# EAGLE design BIRDS3_-Xpanel_FM_Uguisu_v1.1 (EAGLE 9.4.0)
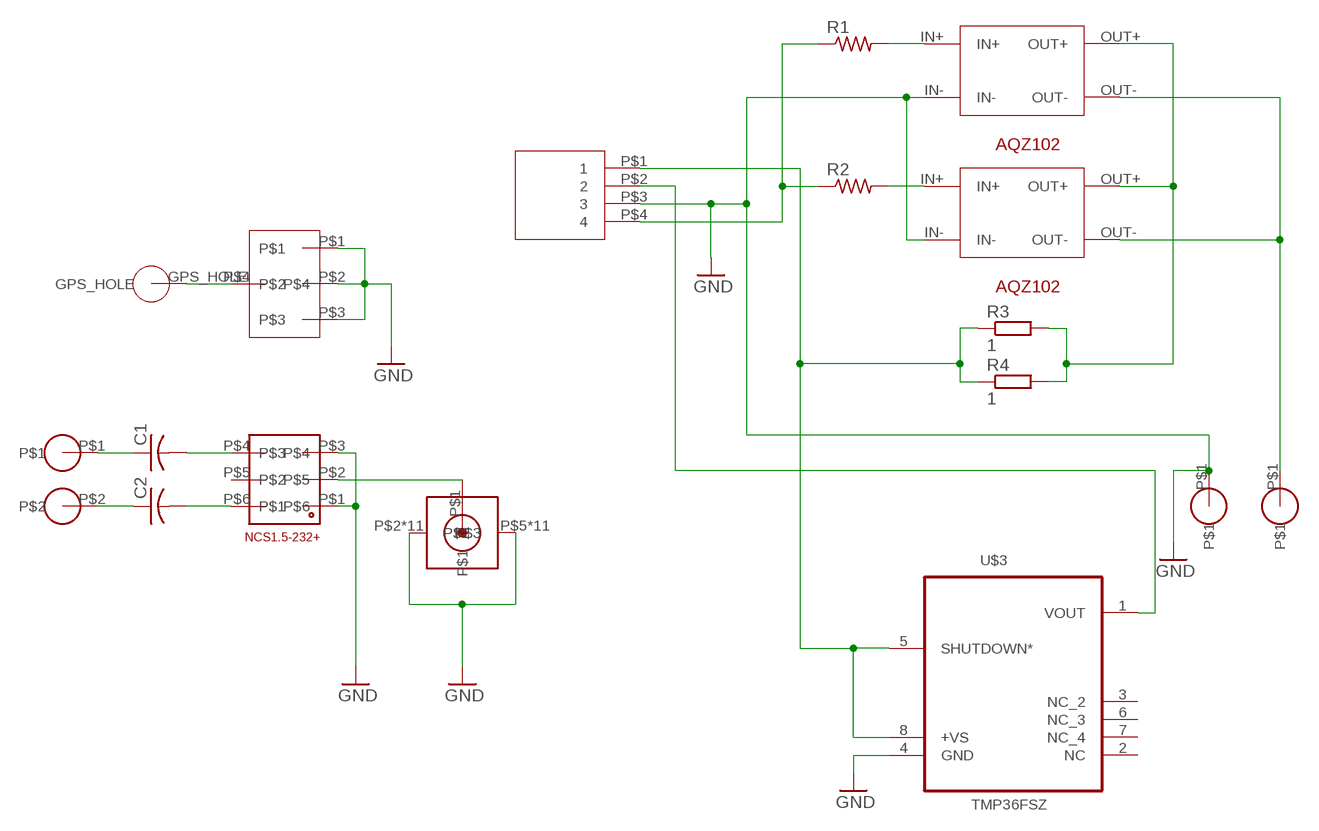
[diagram p0: schematic, sheet 1]

## Parts
142_0711_1  SMA_142_0711_301  [SMA_142_0711_301]
C1  C-USC1608  [C1608]
C2  C-USC1608  [C1608]
GPS1  GPS_HOLE  [GPS_HOLE]
K1  DIODE_X  [DIOD_X]
K2  DIODE_X  [DIOD_X]
MMCX1  MMCX_GPS  [MMCX_GPS]
NCS1  NCS1.5-232+  [NCS1.5-232+]
PRE1  FOR_DIPOLE  [FOR_DIPOLE]
R1  R-US_R0402  [R0402]
R2  R-US_R0402  [R0402]
R3  1  R-EU_R1218  [R1218]
R4  1  R-EU_R1218  [R1218]
U$1  NICR_HOLE  [NICR_HOLE]
U$2  4PIN_HEADER  [4PIN_HEADER]
U$3  TMP36FSZ  [SOIC_N]
U$4  NICR_HOLE  [NICR_HOLE]

## Nets
BC_TEMP_OUT: U$2.P$2 U$3.1(VOUT)
GND: 142_0711_1.P$2 142_0711_1.P$3 142_0711_1.P$4 142_0711_1.P$5 142_0711_1.P$6 142_0711_1.P$7 142_0711_1.P$8 142_0711_1.P$9 142_0711_1.P$10 142_0711_1.P$11 142_0711_1.P$12 142_0711_1.P$13 142_0711_1.P$14 142_0711_1.P$15 142_0711_1.P$16 142_0711_1.P$17 142_0711_1.P$18 142_0711_1.P$19 142_0711_1.P$20 142_0711_1.P$21 142_0711_1.P$22 142_0711_1.P$23 K1.IN- K2.IN- MMCX1.P$1 MMCX1.P$2 MMCX1.P$3 NCS1.P$1 NCS1.P$3 U$2.P$3 U$3.4(GND) U$4.P$1
HOT: K1.OUT- K2.OUT- U$1.P$1
MAIN_PIC_DIO: R1.1 R2.1 U$2.P$4
N$1: K2.IN+ R1.2
N$2: K1.OUT+ K2.OUT+ R3.2 R4.2
N$3: K1.IN+ R2.2
N$4: 142_0711_1.P$1 NCS1.P$2
N$5: C1.1 PRE1.P$1
N$6: C1.2 NCS1.P$4
N$7: C2.2 NCS1.P$6
N$8: C2.1 PRE1.P$2
N$33: GPS1.GPS_HOLE MMCX1.P$4
SUP_UNREG_2: R3.1 R4.1 U$2.P$1 U$3.5(SHUTDOWN*) U$3.8(+VS)
Unconnected: NCS1.P$5 U$3.2(NC) U$3.3(NC_2) U$3.6(NC_3) U$3.7(NC_4)

## Library data of the parts
142_0711_1 = SMA_142_0711_301:SMA_142_0711_301
C1 C2 = adafruit_ufl:C-US: CAPACITOR, American symbol
GPS1 = GPS_hole:GPS_HOLE
K1 K2 = BIRDS-3 lib V1.1:DIODE_X
MMCX1 = MMCX_GPS:MMCX_GPS
NCS1 = NCS1.5-232+:NCS1.5-232+
PRE1 = for_dipole:FOR_DIPOLE: VIA_M1.5
R1 R2 = adafruit_ufl:R-US_: RESISTOR, American symbol
R3 R4 = rcl:R-EU_: RESISTOR, European symbol
U$1 U$4 = Nicr_hole:NICR_HOLE
U$2 = BIRDS-3 lib V1.1:4PIN_HEADER
U$3 = TMP36FSZ:TMP36FSZ

## Board
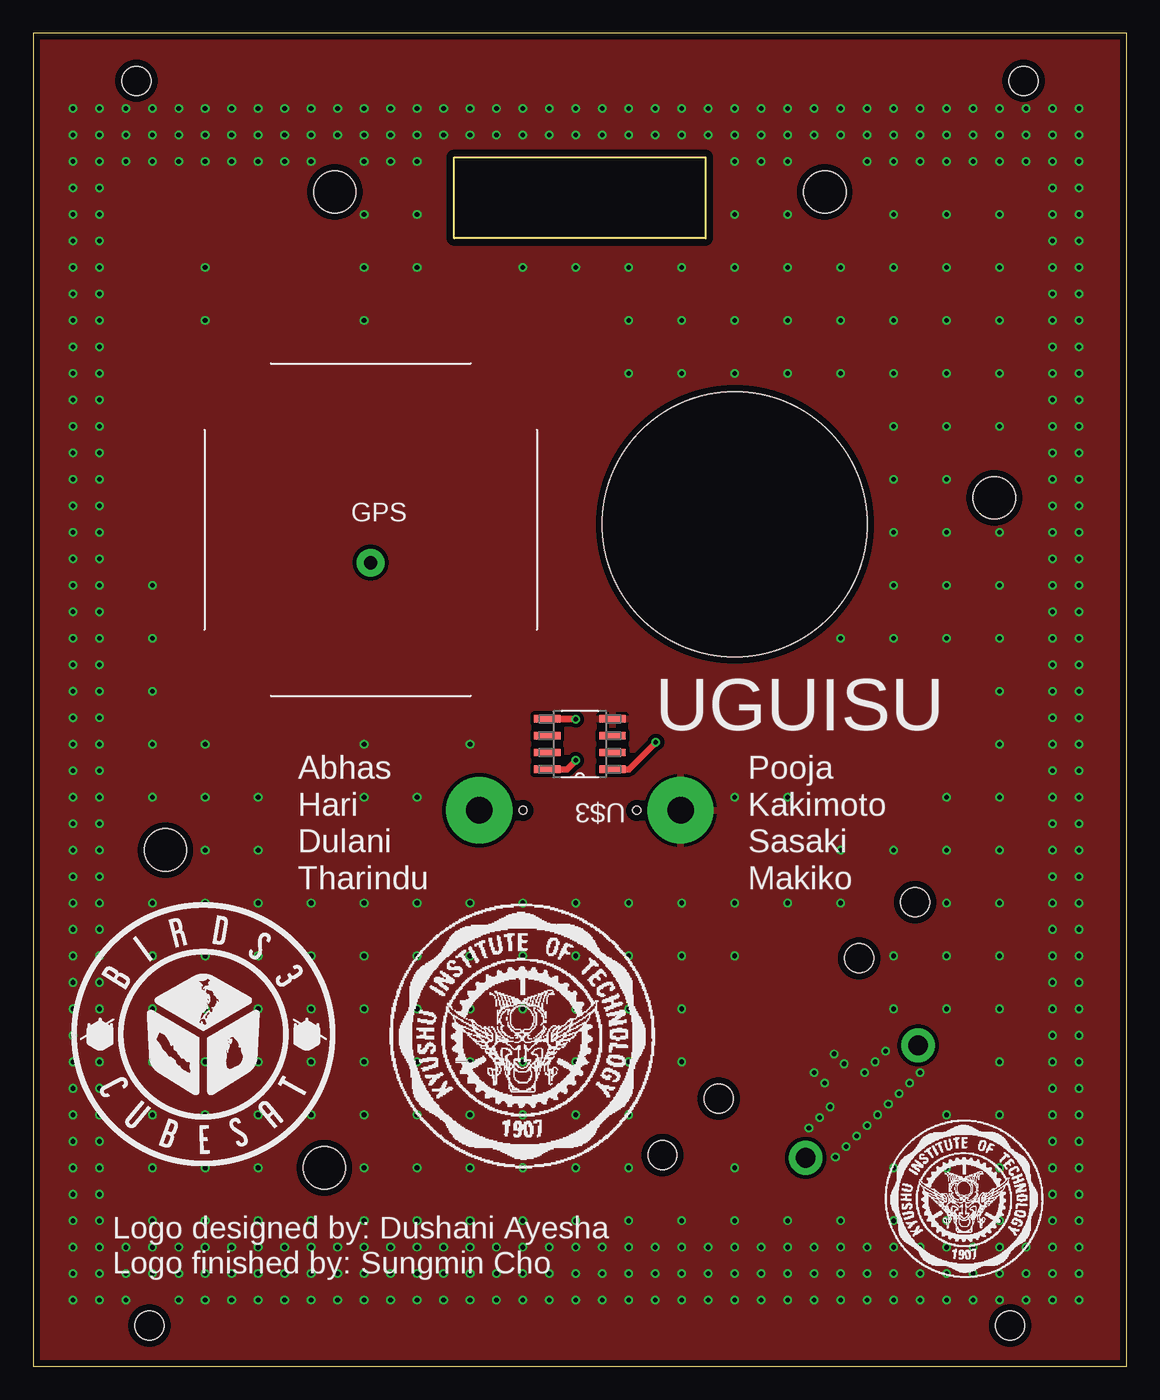
[diagram p1: board, top side]
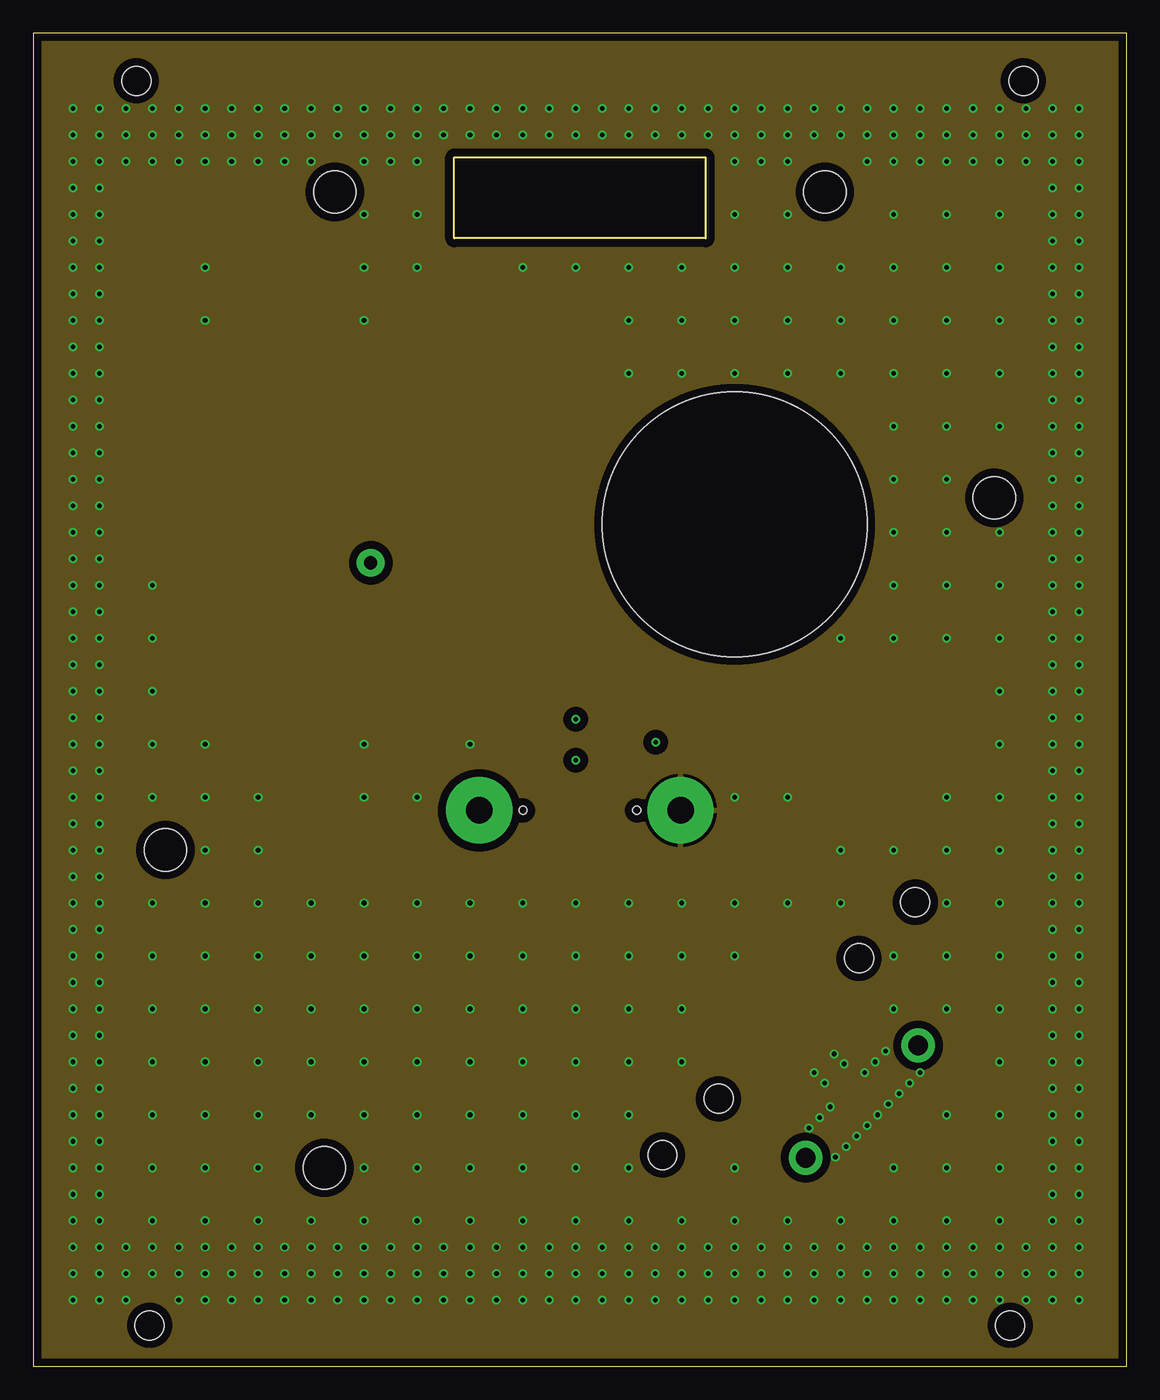
[diagram p2: board, inner layer Route2]
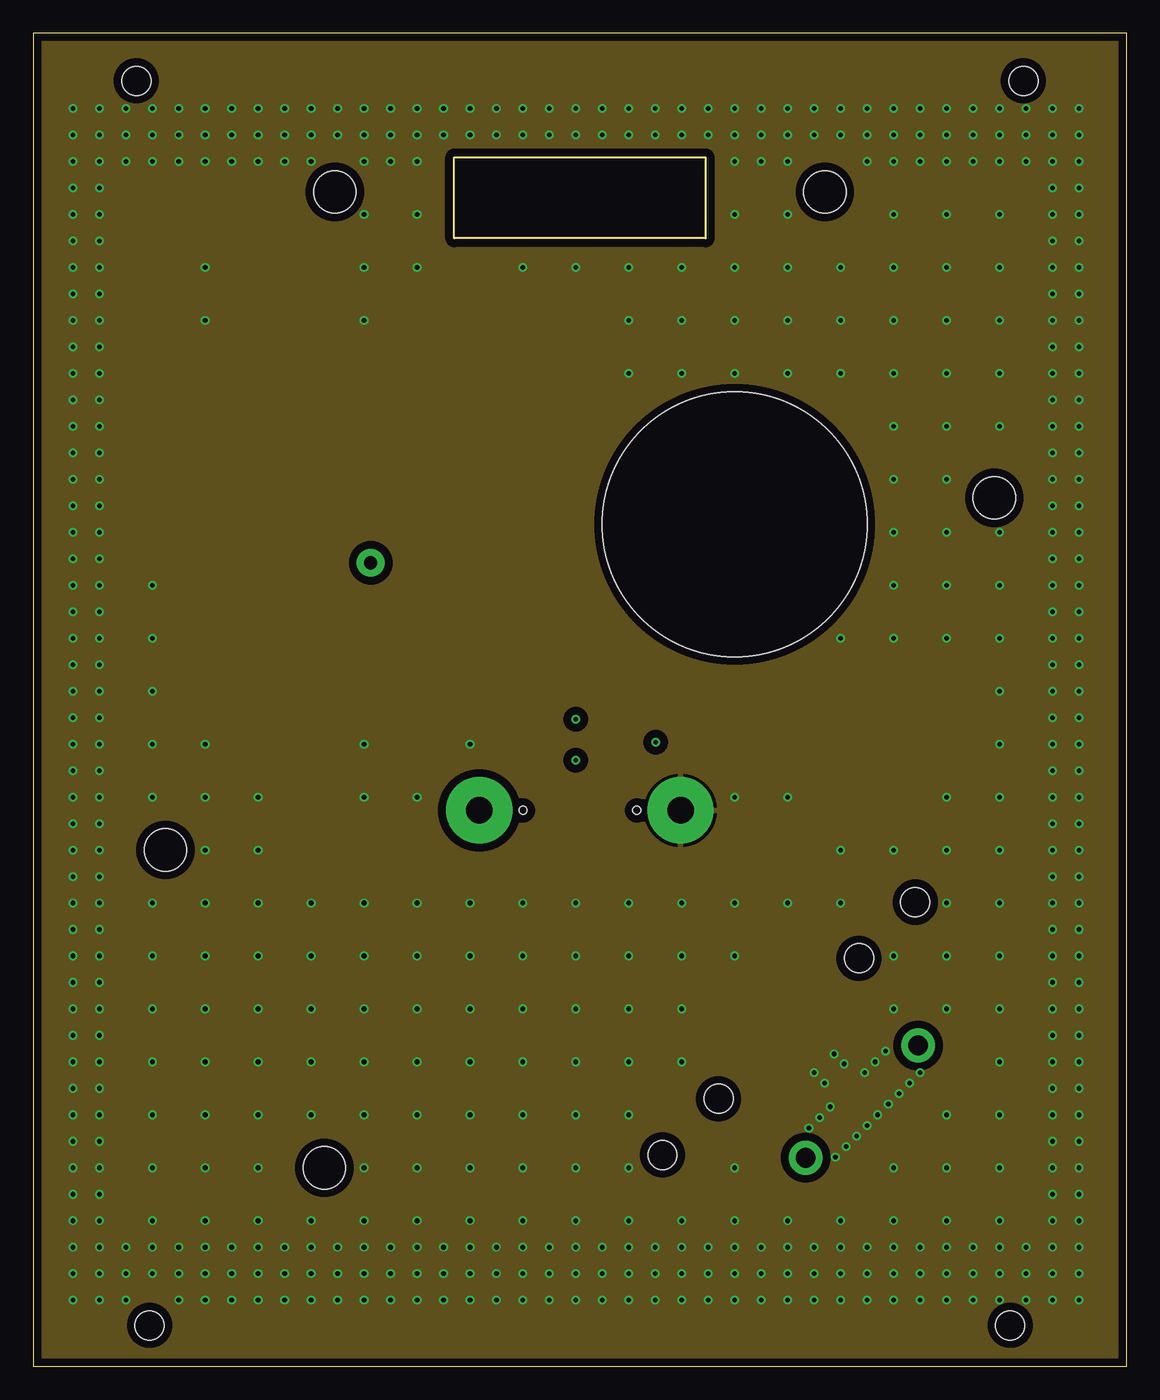
[diagram p3: board, inner layer Route15]
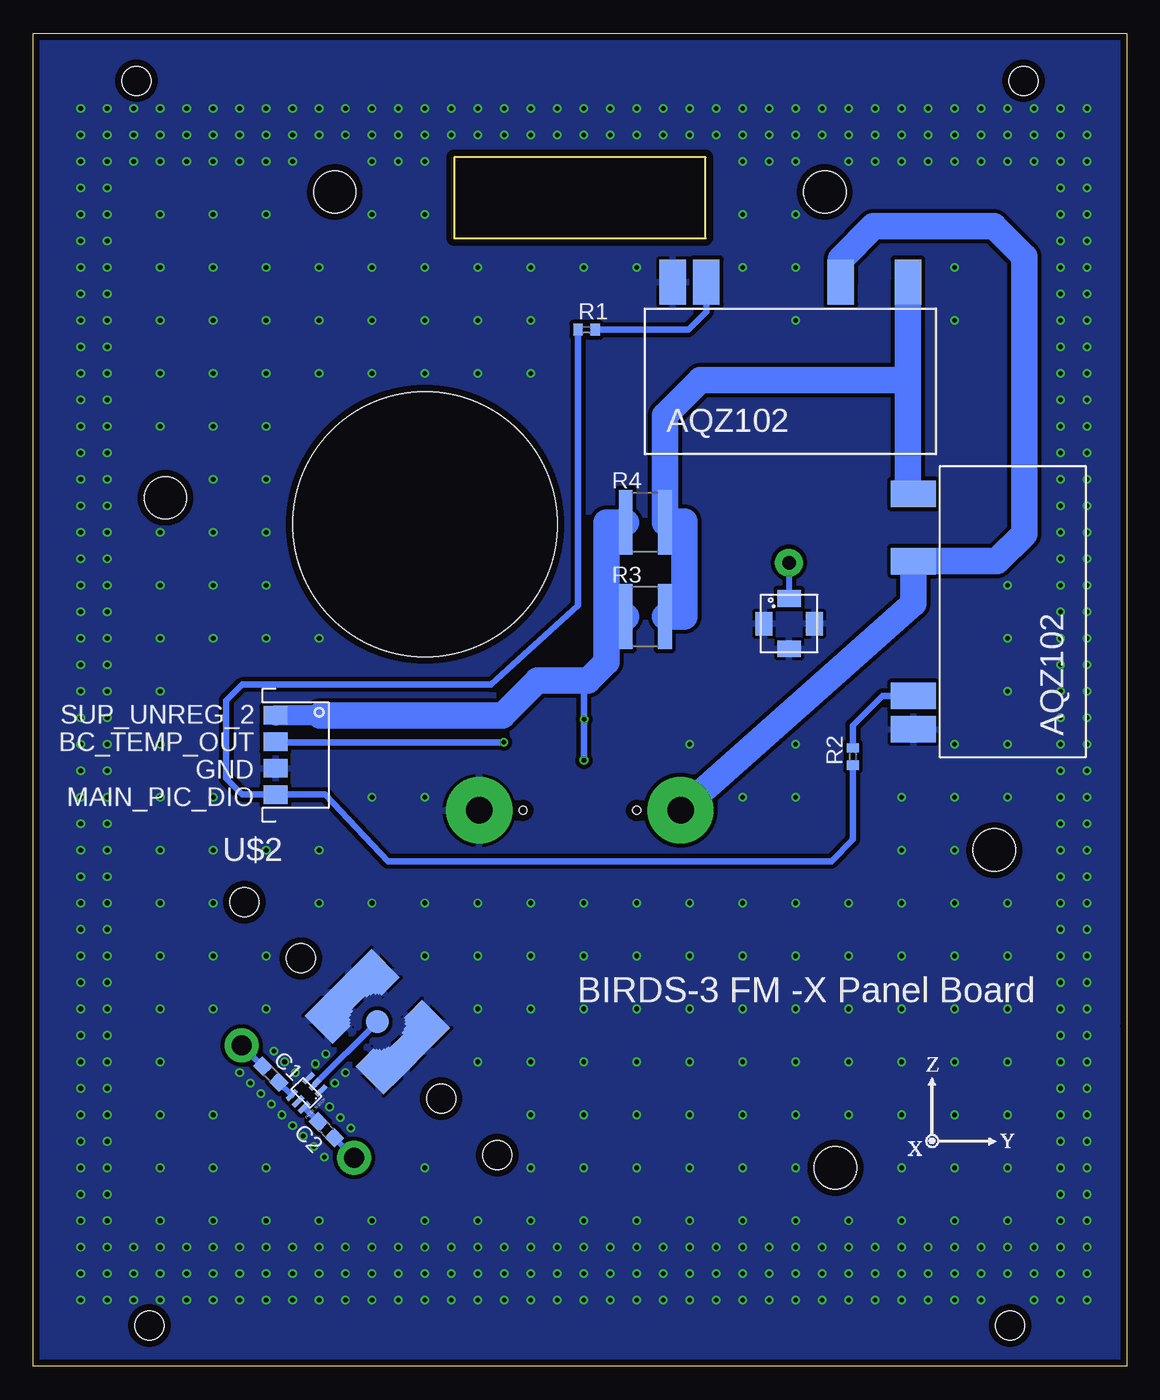
[diagram p4: board, bottom side, seen from below]

Size 82.6 x 100.7 mm. Coordinates in mm from the lower left corner, seen from the top.
Outline: 0,0 41.2,0 82.6,0 82.6,100.7 0,100.7 0,25.7 0,0
Outline: 31.8,85.21 31.8,91.31 50.8,91.31 50.8,85.21 31.8,85.21
Copper layers (1+2*15+16): Top 0.018mm / dielectric 0.25mm / Route2 0.035mm / dielectric 1mm / Route15 0.035mm / dielectric 0.25mm / Bottom 0.018mm
Design rules "pban_5mil-l4": minimum track width 5mil, minimum drill 0.3mm, track to track 5mil, track to pad 0.229mm, pad to pad 5mil, via to via 5mil, smd to smd 5mil, copper to edge 0.5mm, drill to drill 0.5mm, minimum pad ring 0.15mm, minimum via ring 0.15mm, stop-mask expansion 4mil, vias tented up to drill 0.35mm, thermal gap 10mil
Holes 2.2 mm at 7.8,97.1 74.8,97.1 73.8,3.1 8.8,3.1
Holes 3.2 mm at 59.8,88.7 22.8,88.7 72.6,65.6 22,15 10,39
Holes 20 mm at 53,63.6
Holes 0.6 mm at 37,42 45.6,42

### Footprints (pad centres in the part's own frame; a part is rotated, then mirrored left to right if it is on the bottom)
SMA_142_0711_301 = smd 1.73 x 1.73: P$1 0,0 | smd 3 x 1.92: P$2 -2.71,2.6; P$4 -2.71,-2.6; P$5 2.71,-2.6; P$6 2.71,2.6 | smd 2.16 x 3.28: P$3 -3.13,0; P$7 3.13,0 | smd 0.5 x 0.3: P$8 -1.8,1.49; P$9 -1.8,-1.49; P$10 1.8,-1.49; P$11 1.8,1.49 | smd 0.28 x 0.3: P$12 -1.91,1.19; P$13 -1.91,-1.19; P$14 1.91,-1.19; P$15 1.91,1.19 | smd 0.14 x 0.3: P$16 -1.98,0.89; P$17 -1.98,-0.89; P$18 1.98,-0.89; P$19 1.98,0.89 | smd 0.16 x 0.14: P$20 -1.47,1.57; P$21 -1.47,-1.57; P$22 1.47,-1.57; P$23 1.47,1.57
C1608 = smd 1.1 x 1: 1 -0.85,0; 2 0.85,0
GPS_HOLE = drill 1 pad 2.1: GPS_HOLE 0,0
DIOD_X = smd 3.4 x 2: IN+ 0,-6.35; IN- 0,-8.89; OUT+ 0,8.89; OUT- 0,3.81
MMCX_GPS = smd 1.27 x 1.778: P$1 -1.905,0; P$3 1.905,0 | smd 1.778 x 1.27: P$2 0,-1.905; P$4 0,1.905
NCS1.5-232+ = smd 0.36 x 1: P$1 -0.66,-0.9; P$2 0,-0.9; P$3 0.66,-0.9; P$4 0.66,0.9; P$5 0,0.9; P$6 -0.66,0.9
FOR_DIPOLE = drill 1.5 pad 2.54: P$1 -6,0; P$2 6,0 | hole 2.2: -13.5,7.8; -7.5,7.8; 7.5,7.8; 13.5,7.8
R0402 = smd 0.7 x 0.9: 1 -0.65,0; 2 0.65,0
R1218 = smd 1.05 x 4.9: 1 -1.475,0; 2 1.475,0
NICR_HOLE = drill 2 pad 5: P$1 0,0
4PIN_HEADER = smd 1.8 x 1.4: P$1 0,4; P$2 0,2; P$3 0,0; P$4 0,-2
SOIC_N = smd 1.981 x 0.559: 1 -2.464,1.905; 2 -2.464,0.635; 3 -2.464,-0.635; 4 -2.464,-1.905; 5 2.464,-1.905; 6 2.464,-0.635; 7 2.464,0.635; 8 2.464,1.905

### Placement (x,y rotation side)
142_0711_1  56.59,26.02 315 bottom
C1  64.65,22.07 315 bottom
C2  60.45,17.87 135 bottom
GPS1  25.5,60.7 0 top
K1  16.1,57 0 bottom
K2  25.4,81.9 270 bottom
MMCX1  25.5,56.1 0 bottom
NCS1  61.95,20.66 135 bottom
PRE1  62.6,20 315 bottom
R1  40.8,78.3 0 bottom
R2  20.68,46.05 90 bottom
R3  36.36,56.63 0 bottom
R4  36.36,63.75 0 bottom
U$1  33.7,42 0 top
U$2  64.29,45.17 0 bottom
U$3  41.3,47 180 top
U$4  48.9,42 0 top

### Tracks (layer width: path | path; a pad name or v marks a point on that pad's centre or on a via)
BC_TEMP_OUT  (via drill 0.35)
  Top 0.508: U$3.1 45.01,45.09 v47.04,47.13
  Bottom 0.508: v47.04,47.13 64.25,47.13 U$2.P$2
GND  (via drill 0.35)
  Bottom 0.127: 142_0711_1.P$6 142_0711_1.P$11 | 142_0711_1.P$11 142_0711_1.P$23 | 142_0711_1.P$11 142_0711_1.P$15 142_0711_1.P$19 142_0711_1.P$7 142_0711_1.P$18 142_0711_1.P$14 142_0711_1.P$10 | 142_0711_1.P$10 142_0711_1.P$22 | 142_0711_1.P$10 142_0711_1.P$5 | 142_0711_1.P$4 142_0711_1.P$9 | 142_0711_1.P$9 142_0711_1.P$13 142_0711_1.P$17 142_0711_1.P$3 | 142_0711_1.P$3 142_0711_1.P$16 | 142_0711_1.P$3 142_0711_1.P$12 56.88,28.32 | 56.88,28.32 142_0711_1.P$8 142_0711_1.P$2 | 142_0711_1.P$9 142_0711_1.P$21 | 142_0711_1.P$20 56.88,28.32
  other vias: 3,7 5,7 3,9 5,9 7,9 7,7 3,11 5,11 5,13 3,13 9,9 9,7 11,7 11,9 13,9 13,7 15,7 15,9 17,7 17,9 19,9 19,7 21,9 21,7 23,9 23,7 25,9 25,7 29,9 27,9 27,7 29,7 31,7 31,9 33,9 33,7 35,9 35,7 37,9 37,7 39,7 39,9 41,9 41,7 43,9 43,7 45,7 45,9 47,9 47,7 49,9 49,7 51,7 51,9 53,7 55,7 55,9 53,9 57,7 57,9 59,9 59,7 63,7 61,9 61,7 63,9 65,7 67,9 65,9 69,7 67,7 69,9 71,9 73,7 71,7 73,9 75,7 77,9 75,9 77,7 79,9 79,7 79,13 79,11 77,11 77,13 77,15 79,15 79,17 77,17 77,19 79,19 79,21 77,21 77,23 79,23 79,25 77,25 77,27 79,27 79,29 77,29 77,31 79,31 79,33 77,33 77,35 79,37 79,35 77,37 77,39 79,39 79,41 77,41 77,43 79,45 79,43 77,45 77,47 79,47 79,49 79,51 77,49 77,51 79,53 77,53 77,55 79,55 77,57 79,57 79,59 77,59 77,61 79,61 79,63 77,63 77,65 79,65 79,67 77,67 77,69 79,69 77,71 79,71 79,73 77,73 79,75 77,75 77,77 79,77 79,79 77,79 77,81 79,81 79,83 77,83 77,85 79,85 77,87 79,87 79,89 77,89 77,91 79,91 77,93 79,93 75,93 75,91 73,91 73,93 71,93 71,91 69,91 69,93 67,93 67,91 63,91 65,93 65,91 63,93 61,93 59,93 57,93 57,91 55,93 55,91 53,91 53,93 51,93 49,93 47,93 43,93 45,93 41,93 39,93 35,93 37,93 33,93 31,93 29,93 29,91 27,91 25,93 27,93 25,91 21,93 23,93 19,91 19,93 21,91 17,91 17,93 15,93 15,91 13,91 13,93 11,93 11,91 9,91 7,93 9,93 7,91 5,91 5,93 3,91 3,93 3,89 5,89 3,85 3,87 5,87 5,85 5,83 3,83 3,81 3,79 5,81 5,79 3,75 5,75 3,77 5,77 3,73 5,73 3,71 5,71 3,43 5,43 5,41 3,39 3,41 5,37 5,39 3,37 3,35 5,35 5,33 3,33 3,31 5,31 3,29 5,29 5,27 3,27 3,25 5,25 5,23 3,23 3,19 3,21 5,21 5,19 5,17 3,17 3,15 5,15 3,5 5,5 7,5 11,5 13,5 15,5 17,5 19,5 21,5 23,5 25,5 27,5 29,5 31,5 33,5 35,5 37,5 39,5 41,5 43,5 45,5 47,5 49,5 51,5 53,5 55,5 57,5 59,5 61,5 63,5 65,5 67,5 69,5 71,5 73,5 75,5 77,5 79,5 3,95 5,95 7,95 9,95 11,95 13,95 15,95 17,95 19,95 21,95 23,95 25,95 27,95 29,95 31,95 33,95 37,95 35,95 39,95 41,95 43,95 45,95 47,95 49,95 51,95 53,95 57,95 55,95 59,95 63,95 61,95 65,95 67,95 69,95 71,95 73,95 75,95 77,95 79,95 9,19 9,23 9,27 9,31 9,35 13,35 13,31 13,39 13,43 9,43 17,43 17,39 17,35 17,31 17,27 13,27 9,15 9,11 13,11 13,15 13,19 13,23 17,23 17,19 17,15 17,11 21,11 25,11 25,15 21,19 21,23 21,27 21,31 21,35 25,35 25,31 25,27 25,23 25,19 29,35 29,27 29,31 29,23 29,19 29,15 33,15 37,15 29,11 33,11 33,19 33,23 33,27 33,31 33,35 37,35 37,27 37,31 37,23 37,19 37,11 41,11 41,15 41,19 41,23 41,27 41,31 41,35 45,35 45,31 45,27 45,23 45,19 49,23 49,27 57,35 61,35 61,39 65,39 65,31 69,31 69,35 69,39 73,39 73,35 73,31 73,27 73,23 73,19 69,19 69,15 73,15 73,11 69,11 65,11 61,11 57,11 53,11 49,11 45,11 65,15 73,43 73,47 73,51 73,55 69,55 69,59 73,59 73,63 69,63 65,59 65,63 65,67 65,71 69,71 73,71 73,75 69,75 65,75 65,79 69,79 73,79 73,83 73,87 69,87 69,83 65,83 65,87 61,83 61,79 61,75 57,79 57,83 57,87 53,87 53,83 53,79 49,79 49,83 45,79 45,83 41,83 29,87 25,87 45,75 65,55 61,55 60.6,15.8 61.4,16.6 62.2,17.4 63,18.2 63.8,19 64.6,19.8 65.4,20.6 66.2,21.4 67,22.2 58.6,18 59.4,18.8 60.2,19.6 64.4,23.8 63.6,23 62.8,22.2 59,22.2 59.8,21.4 61.27,22.85 60.5,23.6 37,83 29,83 25,83 25,79 13,79 13,83 13,47 9,47 9,51 9,55 9,59 3,69 5,69 3,65 5,67 5,65 5,63 3,63 5,61 3,59 5,59 5,57 5,55 3,57 3,61 3,67 5,53 5,51 5,49 5,47 5,45 3,45 3,47 3,51 3,53 3,55 3,49 25,43 25,47 33,47 29,43 57,43 53,43 69,43 49,35 49,31 53,31 53,35 53,15 69,27 65,27 45,15 49,75 53,75 57,75 69,67
  pour Bottom (isolate 0.305): -1.11,101.51 83.48,101.51 83.58,-1.49 -1.01,-1.49
  pour Top (isolate 0.305): -3.4,103.64 -3.4,-4.53 86.65,-4.53 86.65,104.04 -3.4,104.04
  pour Route2 (isolate 0.6): -2.69,103.28 -2.69,-3.29 85.38,-3.29 85.38,103.28
  pour Route15 (isolate 0.6): -1.88,102.48 -1.88,-2.3 84.59,-2.3 84.59,102.48
HOT
  Bottom 2: U$1.P$1 16.1,57.6 K1.OUT- 9.79,60.81 7.73,62.87 7.73,83.8 10.04,86.11 19.13,86.11 21.6,83.64 K2.OUT-
MAIN_PIC_DIO
  Bottom 0.508: R1.1 41.45,57.47 48,51.5 66.8,51.5 68,50.3 68,44.4 66.8,43.2 64.32,43.2 U$2.P$4 60.53,43.2 55.8,38.15 22.32,38.15 20.68,39.79 R2.1
N$1
  Bottom 0.508: K2.IN+ 31.75,79.65 33.1,78.3 R1.2
N$2
  Bottom 2: 16.51,74.9 K2.OUT+ | 16.51,74.9 16.51,66.3 K1.OUT+ | R3.2 33.4,56.63 33.4,63.8 34.88,63.8 R4.2 34.88,71.81 32.2,74.5 16.91,74.5 16.51,74.9
N$3
  Bottom 0.508: K1.IN+ 18.45,50.65 20.68,48.42 R2.2
N$4
  Bottom 0.451: 142_0711_1.P$1 NCS1.P$2
N$5
  Bottom 0.451: C1.1 PRE1.P$1
N$6
  Bottom 0.451: NCS1.P$4 C1.2
N$7
  Bottom 0.451: NCS1.P$6 C2.2
N$8
  Bottom 0.451: C2.1 PRE1.P$2
N$33
  Bottom 0.451: GPS1.GPS_HOLE MMCX1.P$4
SUP_UNREG_2  (via drill 0.35)
  Top 0.508: v40.98,48.87 40.95,48.91 U$3.5 | U$3.8 40.31,45.09 v40.99,45.77
  Bottom 0.508: v40.99,45.77 v40.99,48.86 v40.98,48.87 40.98,51.52 40.7,51.8
  Bottom 1.5: 60.92,49.16 U$2.P$1
  Bottom 2: R4.1 39.3,63.75 39.3,56.6 | 39.3,56.6 37.84,56.6 R3.1 | 39.3,56.6 39.3,53.2 40.7,51.8 44.5,51.8 47.13,49.17 60.91,49.17 60.92,49.16

### Text on the board
tPlace: GPS | UGUISU | Abhas / Hari / Dulani / Tharindu | Pooja / Kakimoto / Sasaki / Makiko | Logo designed by: Dushani Ayesha / Logo finished by: Sungmin Cho
bPlace: SUP_UNREG_2 / BC_TEMP_OUT / GND / MAIN_PIC_DIO | BIRDS-3 FM -X Panel Board